# Altium schematic sheet PCI Express.SchDoc: PCI Express
size A2; ApprovedBy: JTS; CheckedBy: JTS; DrawnBy: EBC; DocumentNumber: -; Revision: 09; SheetNumber: 7; SheetTotal: 7; SenaiProjectName: EzPower v4
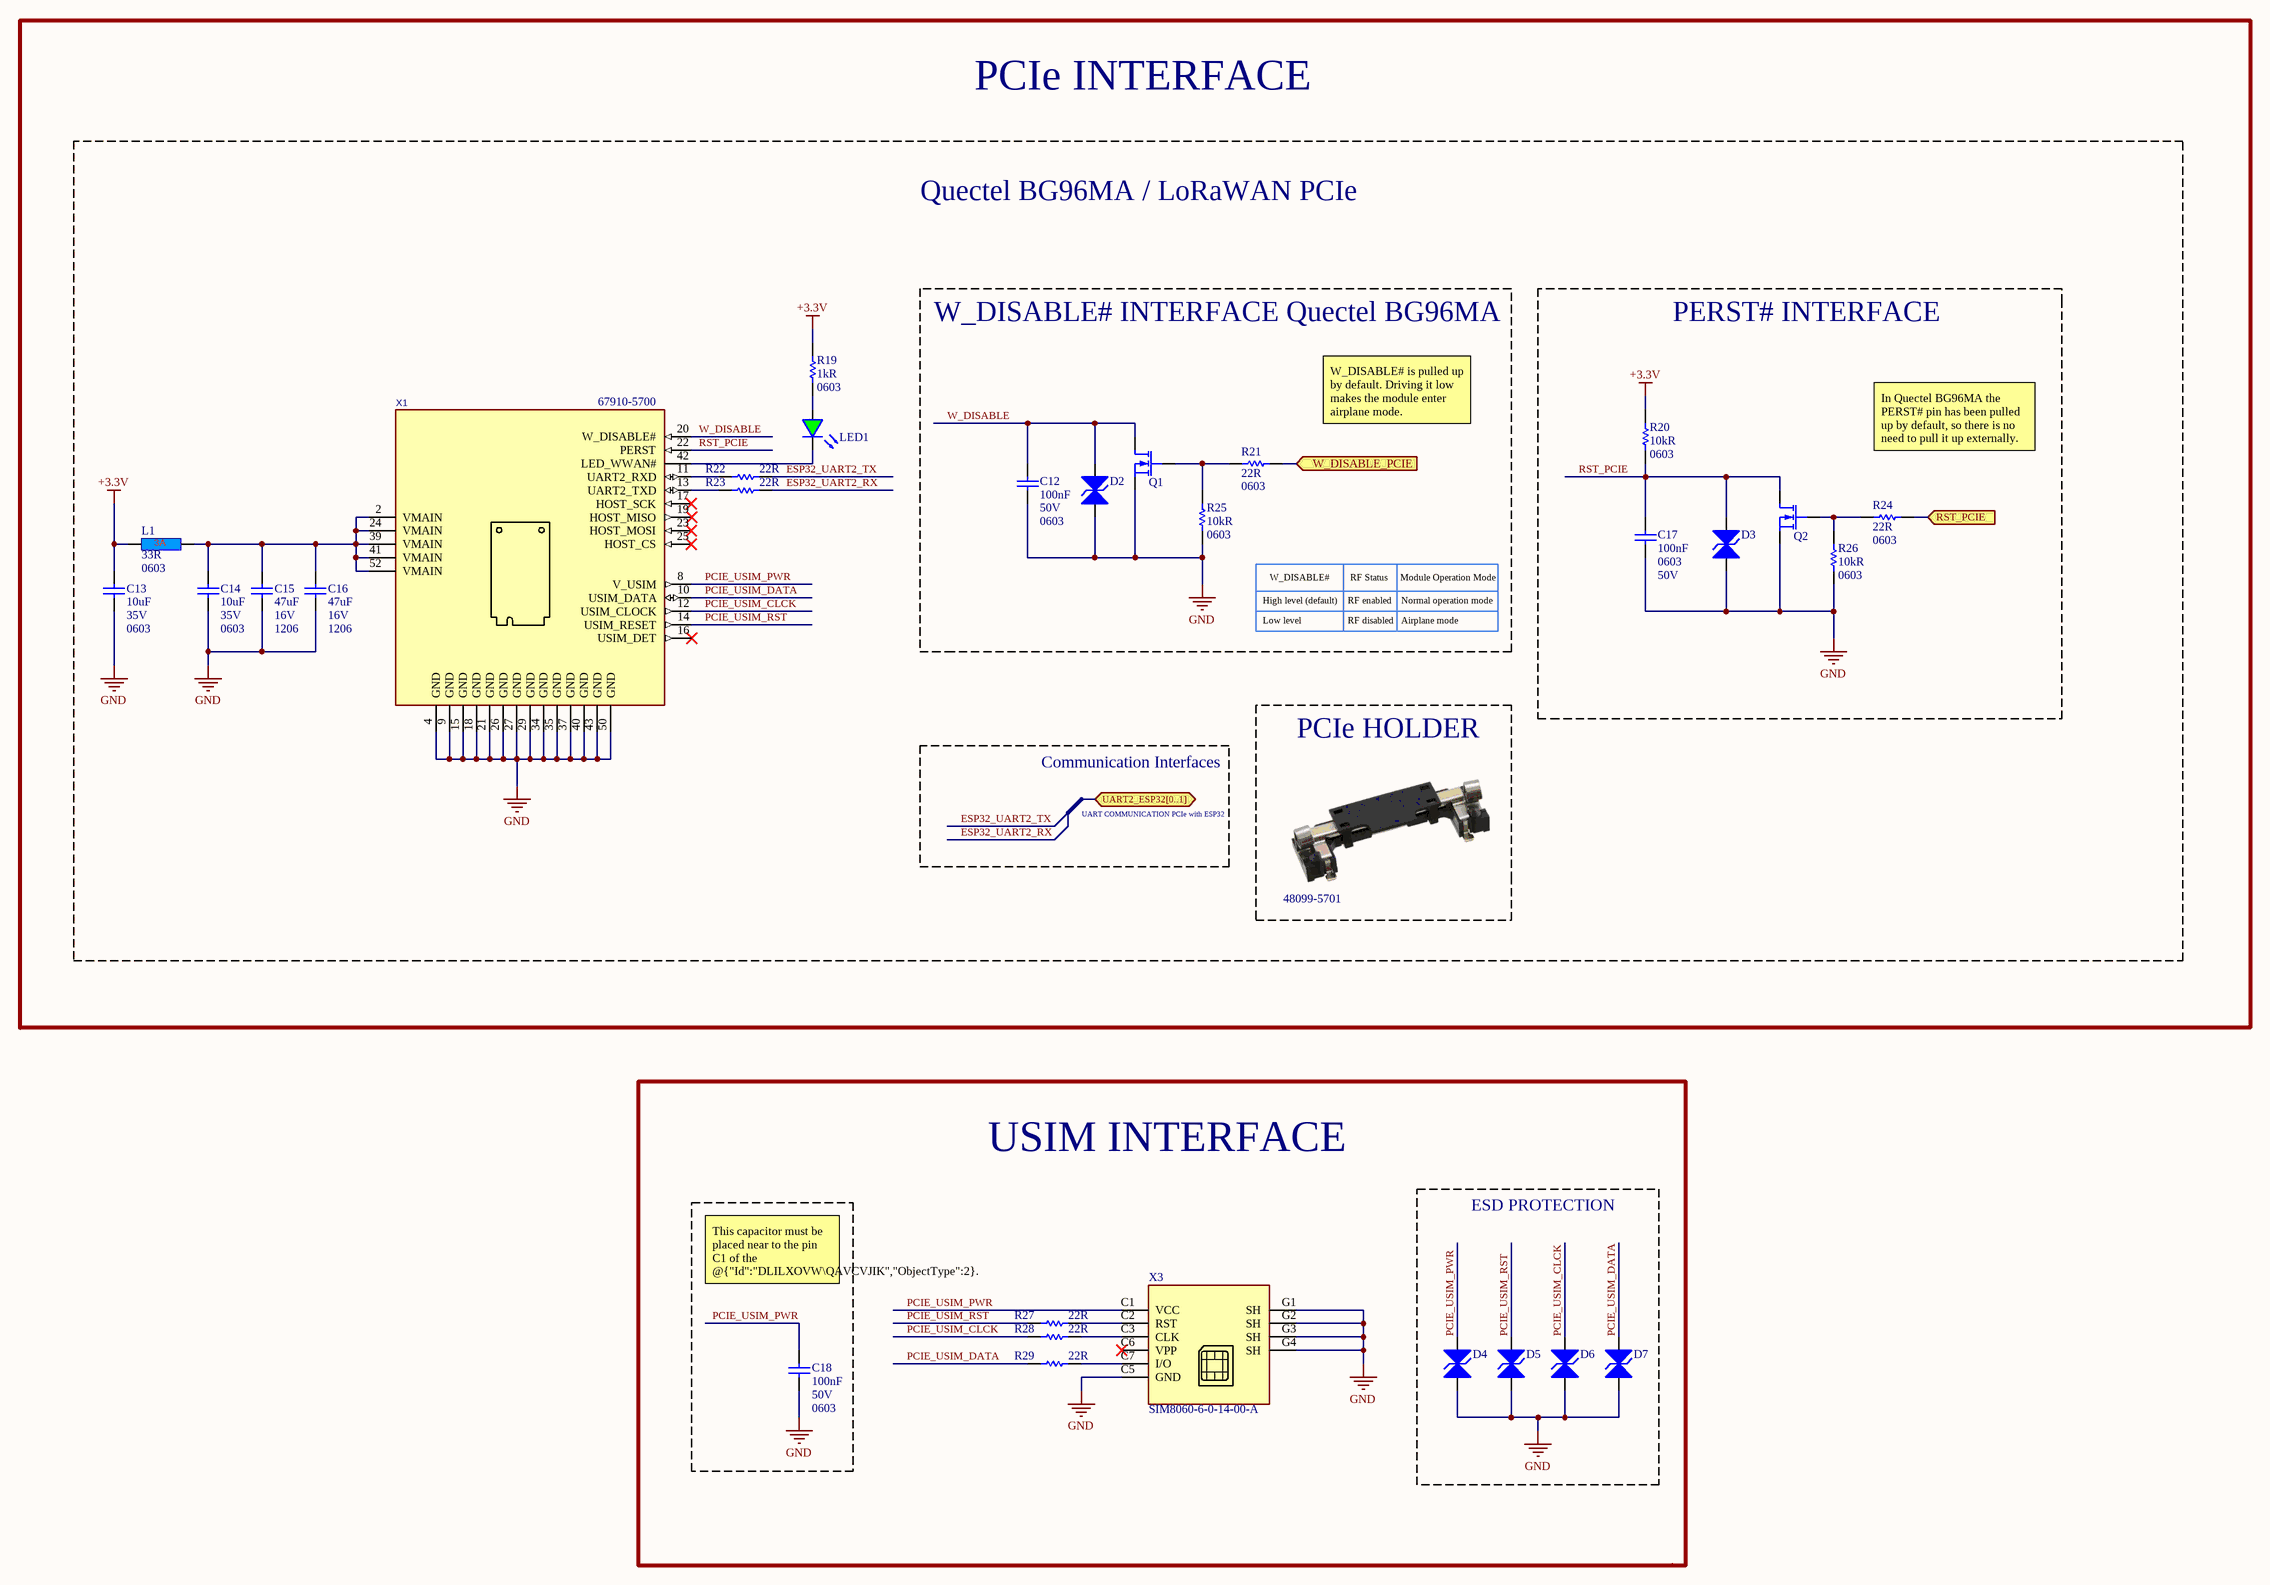
[diagram p0: PCI Express.SchDoc]

## Parts
C12  value 100nF  Case/Package: 0603  Voltage Rating: 50V  [C0603]  (hidden comment: CC0603MRX7R9BB104)
C13  Case/Package: 0603  Capacitance: 10uF  Voltage Rating: 35V  [C0603]  (hidden comment: C_0603_10uF_35V_20%)
C14  Case/Package: 0603  Capacitance: 10uF  Voltage Rating: 35V  [C0603]  (hidden comment: C_0603_10uF_35V_20%)
C15  Package: 1206  Voltage: 16V  Capacitance: 47uF  [C1206]  (hidden comment: GRM31CR61C476ME44K)
C16  Package: 1206  Voltage: 16V  Capacitance: 47uF  [C1206]  (hidden comment: GRM31CR61C476ME44K)
C17  value 100nF  Case/Package: 0603  Voltage Rating: 50V  [C0603]  (hidden comment: CC0603MRX7R9BB104)
C18  value 100nF  Case/Package: 0603  Voltage Rating: 50V  [C0603]  (hidden comment: CC0603MRX7R9BB104)
D2  SD03C-7  [SOD323 - BIDIRECTIONAL]  (value not drawn)
D3  SD03C-7  [SOD323 - BIDIRECTIONAL]  (value not drawn)
D4  SD03C-7  [SOD323 - BIDIRECTIONAL]  (value not drawn)
D5  SD03C-7  [SOD323 - BIDIRECTIONAL]  (value not drawn)
D6  SD03C-7  [SOD323 - BIDIRECTIONAL]  (value not drawn)
D7  SD03C-7  [SOD323 - BIDIRECTIONAL]  (value not drawn)
L1  Impedance: 33R  Case/Package: 0603  [L0603]  (hidden comment: BLM18PG330SZ1D)
LED1  LED 0603 SMD GREEN  [LED0603-GREEN]  (value not drawn)
Q1  RSF015N06FRATL  [TUMT-3]  (value not drawn)
Q2  RSF015N06FRATL  [TUMT-3]  (value not drawn)
R19  Size Code: 0603  Resistance: 1kR  [R0603]  (hidden comment: R_0603_1kR_1%_1/10W)
R20  value 10kR  Case/Package: 0603  [R0603]  (hidden comment: CRCW060310K0JNEBC)
R21  Resistance: 22R  Case Code (Imperial): 0603  [R0603]  (hidden comment: CRCW060322R0FKEAC)
R22  Resistance: 22R  [R0603]  (hidden comment: CRCW060322R0FKEAC)
R23  Resistance: 22R  [R0603]  (hidden comment: CRCW060322R0FKEAC)
R24  Resistance: 22R  Case Code (Imperial): 0603  [R0603]  (hidden comment: CRCW060322R0FKEAC)
R25  value 10kR  Case/Package: 0603  [R0603]  (hidden comment: CRCW060310K0JNEBC)
R26  value 10kR  Case/Package: 0603  [R0603]  (hidden comment: CRCW060310K0JNEBC)
R27  Resistance: 22R  [R0603]  (hidden comment: CRCW060322R0FKEAC)
R28  Resistance: 22R  [R0603]  (hidden comment: CRCW060322R0FKEAC)
R29  Resistance: 22R  [R0603]  (hidden comment: CRCW060322R0FKEAC)
X1  67910-5700  [CON-Molex-67910-5700-Half/Full]
X2  48099-5701
X3  SIM8060-6-0-14-00-A  [CONN SIMCARD]

## Blocks framed on the sheet
Quectel BG96MA / LoRaWAN PCIe: C13-C16 L1 LED1 R19 R22 R23 X1
W_DISABLE# INTERFACE Quectel BG96MA: C12 D2 Q1 R21 R25
PERST# INTERFACE: C17 D3 Q2 R20 R24 R26
PCIe HOLDER: X2
USIM INTERFACE: C18 R27-R29 X3
ESD PROTECTION: D4-D7

## Ports
RST_PCIE (in), UART2_ESP32[0..1] (bidir), W_DISABLE_PCIE (in)

## Nets
+3.3V: C13.1 L1.1 R19.2 R20.2
GND: C12.2 C13.2 C14.2 C15.1 C16.1 C17.2 C18.2 D2.1 D3.1 D4.1 D5.1 D6.1 D7.1 Q1.2(S) Q2.2(S) R25.1 R26.1 X1.4(GND) X1.9(GND) X1.15(GND) X1.18(GND) X1.21(GND) X1.26(GND) X1.27(GND) X1.29(GND) X1.34(GND) X1.35(GND) X1.37(GND) X1.40(GND) X1.43(GND) X1.50(GND) X3.C5(GND) X3.G1(SH) X3.G2(SH) X3.G3(SH) X3.G4(SH)
ESP32_UART2_RX: R23.2
ESP32_UART2_TX: R22.2
PCIE_USIM_CLCK: D6.2 R28.1 X1.12(USIM_CLOCK)
PCIE_USIM_DATA: D7.2 R29.1 X1.10(USIM_DATA)
PCIE_USIM_PWR: C18.1 D4.2 X1.8(V_USIM) X3.C1(VCC)
PCIE_USIM_RST: D5.2 R27.1 X1.14(USIM_RESET)
RST_PCIE: C17.1 D3.2 Q2.3(D) R20.1 X1.22(PERST)
RST_PCIE: R24.1 ; port RST_PCIE  [a separate net that carries the same name]
W_DISABLE: C12.1 D2.2 Q1.3(D) X1.20(W_DISABLE#)
W_DISABLE_PCIE: R21.1 ; port W_DISABLE_PCIE
NetC14_1: C14.1 C15.2 C16.2 L1.2 X1.2(VMAIN) X1.24(VMAIN) X1.39(VMAIN) X1.41(VMAIN) X1.52(VMAIN)
NetLED1_1: LED1.1(A) R19.1
NetLED1_2: LED1.2(K) X1.42(LED_WWAN#)
NetQ1_1: Q1.1(G) R21.2 R25.2
NetQ2_1: Q2.1(G) R24.2 R26.2
NetR22_1: R22.1 X1.11(UART2_RXD)
NetR23_1: R23.1 X1.13(UART2_TXD)
NetR27_2: R27.2 X3.C2(RST)
NetR28_2: R28.2 X3.C3(CLK)
NetR29_2: R29.2 X3.C7(I/O)

Not connected (* = marked no-connect by the designer): X1 16(USIM_DET)* 17(HOST_SCK)* 19(HOST_MISO)* 23(HOST_MOSI)* 25(HOST_CS)*; X3 C6(VPP)*

## Notes on the sheet
- PCIe INTERFACE
- W_DISABLE# is pulled up by default. Driving it low makes the module enter airplane mode.
- In Quectel BG96MA the PERST# pin has been pulled up by default, so there is no need to pull it up externally. Active low.
- High level (default)
- W_DISABLE#
- RF enabled
- RF Status
- Module Operation Mode
- Normal operation mode
- Low level
- RF disabled
- Airplane mode
- Communication Interfaces
- UART COMMUNICATION PCIe with ESP32
- This capacitor must be placed near to the pin C1 of the @{"Id":"DLILXOVW\QAVCVJIK","ObjectType":2}.
- Title:
- Size:
- Project:
- Revision:
- Date:
- Time:
- Variant:
- Drawn by:
- Checked by:
- A2
- Approved by:
- Sheet
- of

## Library data of the parts
C12 C17 C18 = C_0603_0.1uF_50V_20%: Cap Ceramic 50V 20% +Tol 20% -Tol X7R 15% TC 0.1uF SMD 0603; Manufacturer: Yageo; Supplier 1: Arrow Electronics; Manufacturer Part Number: CC0603MRX7R9BB104; RoHS: Yes; Category: Ceramic Capacitors; Stock 1: 19775; Pricing 1: 4000=0,00850, 8000=0,00780, 12000=0,00740, 28000=0,00700, 100000=0,00520 (USD); Mounting Technology: Surface Mount; Case Code (Imperial): 0603; Case Code (Metric): 1608; Min Operating Temperature: -55°C; Max Operating Temperature: 125°C; Packaging: Tape and Reel; Tolerance: 20%; Dielectric: X7R; Voltage Rating (DC): 50V; Series: CC; Length: 0.063inch; Width: 0.031inch; Thickness: 0.035inch; Lead Free: Lead Free; Halogen Free: Halogen Free; RoHS Compliant: Yes; ComponentLink1URL: http://www.yageo.com/documents/recent/UPY-GPHC_X7R_6.3V-to-50V_18.pdf?src-supplier=Digi-Key; ComponentLink1Description: http://www.yageo.com/documents/recent/UPY-GPHC_X7R_6.3V-to-50V_18.pdf?src-supplier=Digi-Key; ComponentLink2URL: https://www.yageo.com/upload/media/product/productsearch/datasheet/mlcc/UPY-GPHC_X7R_6.3V-to-50V_18.pdf?src-supplier=Digi-Key; ComponentLink2Description: https://www.yageo.com/upload/media/product/productsearch/datasheet/mlcc/UPY-GPHC_X7R_6.3V-to-50V_18.pdf?src-supplier=Digi-Key; ComponentLink3URL: http://www.yageo.com/exep/pages/download/literatures/ProductSelectionGuide%202014_Final_2.pdf?src-supplier=Digi-Key; ComponentLink3Description: http://www.yageo.com/exep/pages/download/literatures/ProductSelectionGuide%202014_Final_2.pdf?src-supplier=Digi-Key; Supplier Part Number 1: CC0603MRX7R9BB104
C13 C14 = C_0603_10uF_35V_20%: Cap Ceramic 10uF 35V X5R 20% Pad SMD 0603 85C T/R; Manufacturer: Murata; Manufacturer Part Number: GRM188R6YA106MA73D; Supplier 1: Arrow Electronics; RoHS: Yes; Category: Ceramic Capacitors; Stock 1: 32291; Pricing 1: 1=0,31230, 10=0,18330, 25=0,18150, 100=0,12390, 250=0,12260, 500=0,08640, 1000=0,08550, 3000=0,07600, 6000=0,06650, 15000=0,06580, 30000=0,05360 (USD); Mount: Surface Mount; Case Code (Metric): 1608; Case Code (Imperial): 0603; Min Operating Temperature: -55°C; Max Operating Temperature: 85°C; Packaging: Tape and Reel; Voltage Rating (DC): 35V; Dielectric: X5R; Length: 0.063inch; Width: 0.031inch; Thickness: 0.039inch; RoHS Compliant: Yes; ComponentLink1URL: http://search.murata.co.jp/Ceramy/image/img/A01X/G101/ENG/GRM188R6YA106MA73-01.pdf?src-supplier=Future+Electronics; ComponentLink1Description: http://search.murata.co.jp/Ceramy/image/img/A01X/G101/ENG/GRM188R6YA106MA73-01.pdf?src-supplier=Future+Electronics; ComponentLink2URL: http://search.murata.co.jp/Ceramy/image/img/A01X/G101/ENG/GRM188R6YA106MA73-01.pdf?src-supplier=Digi-Key; ComponentLink2Description: http://search.murata.co.jp/Ceramy/image/img/A01X/G101/ENG/GRM188R6YA106MA73-01.pdf?src-supplier=Digi-Key; ComponentLink3URL: https://www.murata.com/~/media/webrenewal/support/library/catalog/products/capacitor/mlcc/c02e.ashx?la=en-us&src-supplier=Digi-Key; ComponentLink3Description: https://www.murata.com/~/media/webrenewal/support/library/catalog/products/capacitor/mlcc/c02e.ashx?la=en-us&src-supplier=Digi-Key; ComponentLink4URL: http://search.murata.co.jp/Ceramy/image/img/A01X/G101/ENG/GRM188R6YA106MA73-01.pdf?src-supplier=Mouser; ComponentLink4Description: http://search.murata.co.jp/Ceramy/image/img/A01X/G101/ENG/GRM188R6YA106MA73-01.pdf?src-supplier=Mouser; ComponentLink5URL: http://search.murata.co.jp/Ceramy/image/img/A01X/G101/ENG/GRM188R6YA106MA73-01.pdf?src-supplier=TTI; ComponentLink5Description: http://search.murata.co.jp/Ceramy/image/img/A01X/G101/ENG/GRM188R6YA106MA73-01.pdf?src-supplier=TTI; Tolerance: 20%; Supplier Part Number 1: GRM188R6YA106MA73D
C15 C16 = C_1206_47uF_16V_20%: 1206 47 uF 16 V ±20 % Tolerance X5R Surface Mount Multilayer Ceramic Capacitor; Manufacturer: Murata; Supplier 1: Mouser; Manufacturer Part Number: GRM31CR61C476ME44K; RoHS: Yes; Category: Ceramic Capacitors; Stock 1: 101736; Pricing 1: 1=0,78000, 10=0,48100, 50=0,48100, 100=0,42300, 1000=0,28200, 10000=0,24200 (USD); RoHS Compliant: Yes; Supplier Part Number 1: 81-GRM31CR61C476ME4K
D2-D7 = D_TVS_SD03C-7: TVS Diode Bi-Directional 4V 55A 600W 2-Pin SOD-323 T/R; Manufacturer: Diodes; Supplier 1: Rs; RoHS: Yes; Category: TVS Diodes; Stock 1: 700; Pricing 1: 50=0,202, 100=0,109, 250=0,107, 500=0,088, 1000=0,086 (GBP); Supplier Part Number 1: 2060301
L1 = L_0603_25%_3A: Ferrite Beads Multi-Layer Power 33Ohm 25% 100MHz 3A 0.025Ohm DCR 0603 Automotive T/R; Manufacturer: Murata; Number of Lines: 1; DC Resistance: 250mR; Supplier 1: Mouser; Manufacturer Part Number: BLM18PG330SZ1D; RoHS: Yes; Category: Ferrite Beads and Chips; Stock 1: 39713; Pricing 1: 1=0,10000, 10=0,06700, 50=0,06700, 100=0,03600, 1000=0,02900, 10000=0,02300 (USD); Mounting Technology: Surface Mount; Min Operating Temperature: -55°C; Max Operating Temperature: 125°C; Series: EMIFIL®, BLM18; Ratings: AEC-Q200; RoHS Compliant: Yes; Supplier Part Number 1: 81-BLM18PG330SZ1D; Max Current Rating: 3A
LED1 = LED_0603_Green: Smd, Alingap, 0603, Thin, Grn, 571Nm, 35Mcd, Clr, T/R Rohs Compliant: Yes; Manufacturer: Vishay Lite-On; Manufacturer Part Number: LTST-C191KGKT; Lens Color: Colorless; Viewing Angle: 130°; Forward Voltage: 2V; Test Current: 20mA; Lens Transparency: Clear; Wavelength: 574nm; Lens Style: Rectangular,Colorless; Forward Current: 30mA; Number of Elements: 1; Power Dissipation: 75mW; Reverse Voltage: 5V; Supplier 1: RSComponents; RoHS: Yes; Category: LEDs; Stock 1: 36950; Pricing 1: 50=0,16500, 250=0,07500, 500=0,07100, 1250=0,06000, 2500=0,05700, 50=0,11900, 250=0,05400, 500=0,05100, 1250=0,04300, 2500=0,04100 (USD); Mount: Surface Mount; Case/Package: 0603; Number of Pins: 2; Color: Green; Case Code (Metric): 1608; Case Code (Imperial): 0603; Min Operating Temperature: -55°C; Max Operating Temperature: 85°C; Luminous Intensity: 35mcd; Packaging: Tape and Reel; Package Quantity: 1; Dominant Wavelength: 571nm; Illumination Color: Green; Number of LEDs: 1; Power Rating: 75mW; Max Power Dissipation: 75mW; Length: 1.6mm; Width: 0.8mm; Height: 0.55mm; Depth: 0.8mm; Radiation Hardening: No; Lead Free: Lead Free; RoHS Compliant: Yes; ComponentLink1URL: https://datasheet.ciiva.com/2109/ltst-c191kgkt-2109973.pdf?src-supplier=Digi-Key; ComponentLink1Description: https://datasheet.ciiva.com/2109/ltst-c191kgkt-2109973.pdf?src-supplier=Digi-Key; Supplier Part Number 1: 6921010
Q1 Q2 = Q_RSF015N06FRATL_TUMT-3: Transistor Mosfet N-ch 60V 1.5A 3-PIN Tumt T/r; Manufacturer: Rohm; Rds On Max: 290mR; Input Capacitance: 110pF; Max Power Dissipation: 800mW; Supplier 1: Newark; RoHS: Yes; Category: MOSFETs; Stock 1: 15; Pricing 1: 5=0,43000, 10=0,35700, 25=0,31900, 50=0,28100, 100=0,24300, 250=0,21300, 500=0,18300, 1000=0,13700 (USD); Mounting Technology: Surface Mount; Case/Package: SMD/SMT; Packaging: Tape and Reel; Drain to Source Voltage (Vdss): 60V; Continuous Drain Current (ID): 1.5A; ComponentLink1URL: http://rohmfs.rohm.com/en/products/databook/datasheet/discrete/transistor/mosfet/rsf015n06fra-e.pdf?src-supplier=Digi-Key; ComponentLink1Description: http://rohmfs.rohm.com/en/products/databook/datasheet/discrete/transistor/mosfet/rsf015n06fra-e.pdf?src-supplier=Digi-Key; Supplier Part Number 1: 24AC5315; Manufacturer Part Number: RSF015N06FRATL
R19 = R_0603_1kR_1%_1/10W: Res Thick Film 0603 1K Ohm 1% 1/10W ±100ppm/°C Molded SMD Paper T/R; Manufacturer: Vishay; Manufacturer Part Number: CRCW06031K00FKEAC; Power Rating: 100mW; Supplier 1: Digi-Key; RoHS: Yes; Category: Chip SMD Resistors; Stock 1: 2127199; Pricing 1: 1=0,10000, 10=0,03400, 100=0,01390, 1000=0,00624, 2500=0,00542 (USD); Mount: Surface Mount; Case/Package: Molded; Contact Plating: Tin; Min Operating Temperature: -55°C; Max Operating Temperature: 155°C; Tolerance: 1%; Resistor Type: Thick Film; Termination: Wraparound; Temperature Coefficient: 100ppm/°C; Length: 1.55mm; Lead Free: Lead Free; RoHS Compliant: Yes; ComponentLink1URL: http://www.vishay.com/docs/28773/crcwce3.pdf?src-supplier=Digi-Key; ComponentLink1Description: http://www.vishay.com/docs/28773/crcwce3.pdf?src-supplier=Digi-Key; Supplier Part Number 1: 541-3949-1-ND
R20 R25 R26 = R_0603_10kR_5%_1/10W: Fixed Resistor, Metal Glaze/thick Film, 0.1W, 10000ohm, 75V, 5% +/-Tol, 200ppm/Cel, Surface Mount, 0603; Manufacturer: Vishay; Power: 100mW; Temperature Coefficient: -200200ppm/°C; Package Height: 0.45mm; Package Length: 1.6mm; Package Width: 0.8mm; Supplier: Mouser; Supplier Part Number: 71-CRCW060310K0JNEBC; Manufacturer Part Number: CRCW060310K0JNEBC; RoHS: Yes; Category: Chip SMD Resistors; Stock: 170759; Pricing: 1=0,1, 10=0,014, 50=0,014, 100=0,008, 1000=0,007, 10000=0,003 (USD); Pins: 2; Terminal Finish: Nickel; Min Operating Temperature: -55°C; Max Operating Temperature: 155°C; Tolerance: 5%; JESD-609 Code: e3; Resistor Type: FIXED RESISTOR; Construction: Chip; Package Style: SMTMeter; Packaging: Tape and Reel; Technology: METAL GLAZE/THICK FILM; Working Voltage: 75V; Reach SVHC Compliant: Yes; RoHS Compliant: Yes; ComponentLink1URL: https://datasheet.ciiva.com:443/pdfs/VipMasterIC/IC/VISH/VISH-S-A0003599164/VISH-S-A0003599164-1.pdf?src-supplier=IHS+Markit; ComponentLink1Description: https://datasheet.ciiva.com:443/pdfs/VipMasterIC/IC/VISH/VISH-S-A0003599164/VISH-S-A0003599164-1.pdf?src-supplier=IHS+Markit; ComponentLink2URL: http://www.vishay.com/docs/28773/crcwce3.pdf?src-supplier=Digikey; ComponentLink2Description: http://www.vishay.com/docs/28773/crcwce3.pdf?src-supplier=Digikey
R21 R24 = R_0603_22R_1%_1/10W: Thick Film Resistors - SMD 1/10Watt 22ohms 1% Commercial Use; Manufacturer: Vishay; Temperature Coefficient: 100ppm/°C; Supplier 1: Mouser; Manufacturer Part Number: CRCW060322R0FKEAC; Stock 1: 59616; Pricing 1: 1=0.1, 10=0.036, 100=0.014, 500=0.009, 1000=0.005, 5000=0.004 (USD); Case/Package: 0603; Case Code (Metric): 1608; Min Operating Temperature: -55°C; Max Operating Temperature: 155°C; Composition: Thick Film; Packaging: Cut Tape; Tolerance: 1%; Number of Terminations: 2; Supplier 2: Digi-Key; Supplier Part Number 1: 71-CRCW060322R0FKEAC; Supplier Part Number 2: 541-4025-6-ND
R22 R23 R27-R29 = R_0603_22R_1%_1/10W: Thick Film Resistors - SMD 1/10Watt 22ohms 1% Commercial Use; Manufacturer: Vishay; Temperature Coefficient: 100ppm/°C; Max Power Dissipation: 100mW; Supplier 1: Mouser; Manufacturer Part Number: CRCW060322R0FKEAC; Stock 1: 59616; Pricing 1: 1=0.1, 10=0.036, 100=0.014, 500=0.009, 1000=0.005, 5000=0.004 (USD); Case/Package: 0603; Case Code (Metric): 1608; Min Operating Temperature: -55°C; Max Operating Temperature: 155°C; Composition: Thick Film; Packaging: Cut Tape; Tolerance: 1%; Number of Terminations: 2; Supplier 2: Digi-Key; Supplier Part Number 1: 71-CRCW060322R0FKEAC; Supplier Part Number 2: 541-4025-6-ND; Case Code (Imperial): 0603
X1 = CON-Molex-67910-5700: Conn Mini PCI Express Card Edge F 52 POS 0.8mm Solder RA SMD Mini PCI Express Embossed T/R; Manufacturer Name: Molex; Contact Resistance: 55mR; Gender: Female; Number of Circuits: 52; Supplier 1: Mouser; Manufacturer: Molex; RoHS: Yes; Category: Card Edge Connectors; Stock 1: 5645; Pricing 1: 1=5,26000, 10=4,64000, 50=4,64000, 100=3,70000, 1000=3,13000, 10000=3,02000 (USD); Contact Plating: Gold; Contact Material: Bronze; Housing Color: Black; Housing Material: Polymer; Min Operating Temperature: -40°C; Max Operating Temperature: 80°C; Packaging: Tape and Reel; Number of Rows: 2; Termination: Solder; Orientation: Right Angle; Pitch: 0.8mm; RoHS Compliant: Yes; ComponentLink1URL: https://datasheet.ciiva.com/23751/725761-23751171.pdf?src-supplier=Newark; ComponentLink1Description: https://datasheet.ciiva.com/23751/725761-23751171.pdf?src-supplier=Newark; ComponentLink2URL: https://datasheet.ciiva.com/15180/getdatasheetpartid-152461-15180122.pdf?src-supplier=Verical; ComponentLink2Description: https://datasheet.ciiva.com/15180/getdatasheetpartid-152461-15180122.pdf?src-supplier=Verical; Supplier Part Number 1: 538-67910-5700; Manufacturer Part Number: 67910-5700
X2 = PCIE Holder: Connector Accessory, Latch, 67910 Series Edge Card Connectors Rohs Compliant: Yes; Manufacturer: Molex; Supplier 1: Mouser; Manufacturer Part Number: 48099-5701; RoHS: Yes; Category: Memory Connectors; Stock 1: 5477; Pricing 1: 1=2,11, 10=1,81, 50=1,81, 100=1,49, 1000=1,18, 10000=1,04 (USD); Contact Material: Stainless Steel; Contact Plating: Gold; Housing Material: Polyamide; Weight: 0.044092oz; Min Operating Temperature: -40°C; Max Operating Temperature: 80°C; Packaging: Tape and Reel; Orientation: Straight; Package Quantity: 2400; Series: 48099; Length: 28.44mm; RoHS Compliant: Yes; Reach SVHC Compliant: Unknown; Supplier Part Number 1: 538-48099-5701
X3 = P_SIMCARD_SIM8060-6-0-14-00-A: Nano SIM Hinged, 6P, 1.43mmH, 1µ", No Peg, No Switch, T&R; Manufacturer: Global Connector Technology; Number of Positions: 6; Supplier 1: Newark; Manufacturer Part Number: SIM8060-6-0-14-00-A; RoHS: No; Category: Connectors; Stock 1: 6000; Pricing 1: 1=1,63, 100=1,29, 250=1,17, 500=1,07, 1000=0,991, 1500=0,991 (USD); Mounting Technology: Surface Mount; Contact Plating: Gold; Series: SIM8060; Packaging: Cut Tape; ComponentLink1URL: https://datasheet.octopart.com/SIM8060-6-0-14-00-A-Global-Connector-Technology-datasheet-128083790.pdf?src-supplier=Future+Electronics; ComponentLink1Description: https://datasheet.octopart.com/SIM8060-6-0-14-00-A-Global-Connector-Technology-datasheet-128083790.pdf?src-supplier=Future+Electronics; ComponentLink2URL: https://gct.co/files/drawings/sim8060.pdf?src-supplier=Digi-Key; ComponentLink2Description: https://gct.co/files/drawings/sim8060.pdf?src-supplier=Digi-Key